# EAGLE design Test board_v3 (EAGLE 6.5.0)
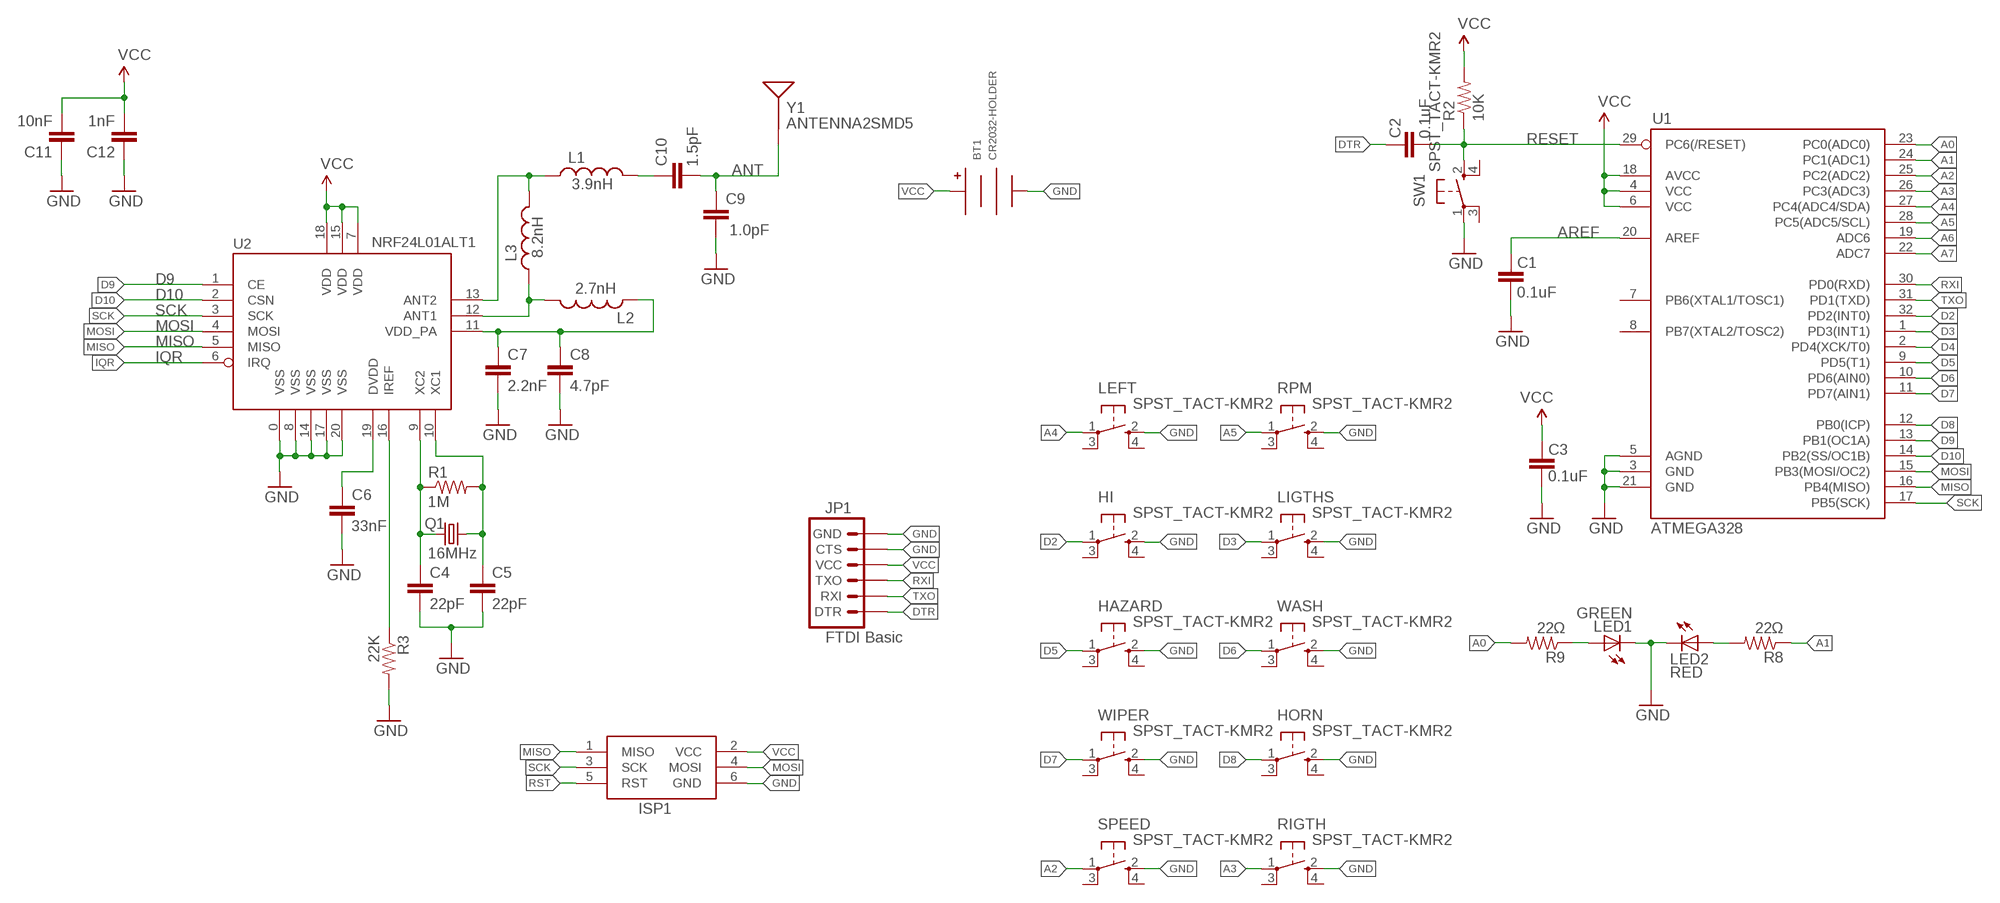
[diagram p0: schematic, sheet 1]

## Parts
BT1  CR2032-HOLDER  [CH28-2032LF]
C1  0.1uF  CAP0402-CAP  [0402-CAP]
C2  0.1uF  CAP0402-CAP  [0402-CAP]
C3  0.1uF  CAP0402-CAP  [0402-CAP]
C4  22pF  CAP0402-CAP  [0402-CAP]
C5  22pF  CAP0402-CAP  [0402-CAP]
C6  33nF  CAP0402-CAP  [0402-CAP]
C7  2.2nF  CAP0402-CAP  [0402-CAP]
C8  4.7pF  CAP0402-CAP  [0402-CAP]
C9  1.0pF  CAP0402-CAP  [0402-CAP]
C10  1.5pF  CAP0402-CAP  [0402-CAP]
C11  10nF  CAP0402-CAP  [0402-CAP]
C12  1nF  CAP0402-CAP  [0402-CAP]
HAZARD  SPST_TACT-KMR2  [KMR2]
HI  SPST_TACT-KMR2  [KMR2]
HORN  SPST_TACT-KMR2  [KMR2]
ISP1  AVRISP-6  [AVRISP]
JP1  FTDI Basic  ARDUINO_SERIAL_PROGRAMPTH  [1X06]
L1  3.9nH  INDUCTOR0402  [C0402]
L2  2.7nH  INDUCTOR0402  [C0402]
L3  8.2nH  INDUCTOR0402  [C0402]
LED1  GREEN  LEDCHIP-LED0603  [CHIP-LED0603]
LED2  RED  LEDCHIP-LED0603  [CHIP-LED0603]
LEFT  SPST_TACT-KMR2  [KMR2]
LIGTHS  SPST_TACT-KMR2  [KMR2]
Q1  16MHz  CRYSTAL5X3  [CRYSTAL-SMD-5X3]
R1  1M  RESISTOR0402-RES  [0402-RES]
R2  10K  RESISTOR0402-RES  [0402-RES]
R3  22K  RESISTOR0402-RES  [0402-RES]
R8  22Ω  R-US_R0402  [R0402]
R9  22Ω  R-US_R0402  [R0402]
RIGTH  SPST_TACT-KMR2  [KMR2]
RPM  SPST_TACT-KMR2  [KMR2]
SPEED  SPST_TACT-KMR2  [KMR2]
SW1  SPST_TACT-KMR2  [KMR2]
U1  ATMEGA328  ATMEGA168  [TQFP32-08]
U2  NRF24L01ALT1  [QFN20_ALT1]
WASH  SPST_TACT-KMR2  [KMR2]
WIPER  SPST_TACT-KMR2  [KMR2]
Y1  ANTENNA2SMD5  [ANTENNA-CHIP5]

## Nets
A0: R9.2 U1.23(PC0(ADC0))
A1: R8.1 U1.24(PC1(ADC1))
A2: SPEED.1(P) U1.25(PC2(ADC2))
A3: RIGTH.1(P) U1.26(PC3(ADC3))
A4: LEFT.1(P) U1.27(PC4(ADC4/SDA))
A5: RPM.1(P) U1.28(PC5(ADC5/SCL))
A6: U1.19(ADC6)
A7: U1.22(ADC7)
ANT: C9.2 C10.2 Y1.FEED(SIGNAL)
AREF: C1.2 U1.20(AREF)
D2: HI.1(P) U1.32(PD2(INT0))
D3: LIGTHS.1(P) U1.1(PD3(INT1))
D4: U1.2(PD4(XCK/T0))
D5: HAZARD.1(P) U1.9(PD5(T1))
D6: U1.10(PD6(AIN0)) WASH.1(P)
D7: U1.11(PD7(AIN1)) WIPER.1(P)
D8: HORN.1(P) U1.12(PB0(ICP))
D9: U1.13(PB1(OC1A)) U2.1(CE)
D10: U1.14(PB2(SS/OC1B)) U2.2(CSN)
DTR: C2.2 JP1.1(DTR)
GND [vcc]: BT1.NEG C1.1 C3.1 C4.2 C5.2 C6.2 C7.2 C8.2 C9.1 C11.1 C12.1 HAZARD.2(S) HI.2(S) HORN.2(S) ISP1.6(GND) JP1.5(CTS) JP1.6(GND) LED1.C LED2.C LEFT.2(S) LIGTHS.2(S) R3.2 RIGTH.2(S) RPM.2(S) SPEED.2(S) SW1.1(P) U1.3(GND) U1.5(AGND) U1.21(GND) U2.0(VSS) U2.8(VSS) U2.14(VSS) U2.17(VSS) U2.20(VSS) WASH.2(S) WIPER.2(S)
IQR: U2.6(IRQ)
MISO: ISP1.1(MISO) U1.16(PB4(MISO)) U2.5(MISO)
MOSI: ISP1.4(MOSI) U1.15(PB3(MOSI/OC2)) U2.4(MOSI)
N$1: C4.1 Q1.1 R1.1 U2.9(XC2)
N$2: C5.1 Q1.3 R1.2 U2.10(XC1)
N$8: L1.1 L3.2 U2.13(ANT2)
N$10: LED2.A R8.2
N$11: LED1.A R9.1
N$12: C7.1 C8.1 L2.1 U2.11(VDD_PA)
N$13: R3.1 U2.16(IREF)
N$14: C6.1 U2.19(DVDD)
N$15: L2.2 L3.1 U2.12(ANT1)
N$16: C10.1 L1.2
RESET: C2.1 R2.1 SW1.2(S) U1.29(PC6(/RESET))
RST: ISP1.5(RST)
RXI: JP1.3(TXO) U1.30(PD0(RXD))
SCK: ISP1.3(SCK) U1.17(PB5(SCK)) U2.3(SCK)
TXO: JP1.2(RXI) U1.31(PD1(TXD))
VCC: BT1.POS C3.2 C11.2 C12.2 ISP1.2(VCC) JP1.4(VCC) R2.2 U1.4(VCC) U1.6(VCC) U1.18(AVCC) U2.7(VDD) U2.15(VDD) U2.18(VDD)
Unconnected: HAZARD.3(P1) HAZARD.4(S1) HI.3(P1) HI.4(S1) HORN.3(P1) HORN.4(S1) LEFT.3(P1) LEFT.4(S1) LIGTHS.3(P1) LIGTHS.4(S1) RIGTH.3(P1) RIGTH.4(S1) RPM.3(P1) RPM.4(S1) SPEED.3(P1) SPEED.4(S1) SW1.3(P1) SW1.4(S1) U1.7(PB6(XTAL1/TOSC1)) U1.8(PB7(XTAL2/TOSC2)) WASH.3(P1) WASH.4(S1) WIPER.3(P1) WIPER.4(S1)

## Library data of the parts
BT1 = battery-holder:CR2032-HOLDER
C1-C12 = SparkFun:CAP: Capacitor Standard 0603 ceramic capacitor, and 0.1" leaded capacitor.
HAZARD HI HORN LEFT LIGTHS RIGTH RPM SPEED SW1 WASH WIPER = adafruit:SPST_TACT: SMT 6mm switch, EVQQ2 series http://www.ladyada.net/library/eagle
ISP1 = adafruit:AVRISP: AVR ISP HEADER Standard 6 pin header for AVR programming
JP1 = SparkFun:ARDUINO_SERIAL_PROGRAM
L1-L3 = SparkFun:INDUCTOR: Inductors Basic Inductor/Choke - 0603 and 1206. Footprints are not proven and vary greatly between part numbers.
LED1 LED2 = adafruit:LED: LED OSRAM: - CHIPLED LG R971, LG N971, LY N971, LG Q971, LY Q971, LO R971, LY R971 LH N974, LH R974 LS Q976, LO Q976, LY Q976 LO Q996 - Hyper CHIPLED LW Q18S LB Q993, LB Q99A, LB R99A - SideLED LS A670, LO A670, LY A670, LG A670, LP A670 LB A673, LV A673, LT A673, LW A673 LH A674 LY A675 LS A676, LA A676, LO A676, LY A676, LW A676 LS A679, LY A679, LG A679 - Hyper Micro SIDELED® LS Y876, LA Y876, LO Y876, LY Y876 LT Y87S - SmartLED LW L88C, LW L88S LB L89C, LB L89S, LG L890 LS L89K, LO L89K, LY L89K LS L896, LA L896, LO L896, LY L896 - TOPLED LS T670, LO T670, LY T670, LG T670, LP T670 LSG T670, LSP T670, LSY T670, LOP T670, LYG T670 LG T671, LOG T671, LSG T671 LB T673, LV T673, LT T673, LW T673 LH T674 LS T676, LA T676, LO T676, LY T676, LB T676, LH T676, LSB T676, LW T676 LB T67C, LV T67C, LT T67C, LS T67K, LO T67K, LY T67K, LW E67C LS E67B, LA E67B, LO E67B, LY E67B, LB E67C, LV E67C, LT E67C LW T67C LS T679, LY T679, LG T679 LS T770, LO T770, LY T770, LG T770, LP T770 LB T773, LV T773, LT T773, LW T773 LH T774 LS E675, LA E675, LY E675, LS T675 LS T776, LA T776, LO T776, LY T776, LB T776 LHGB T686 LT T68C, LB T68C - Hyper Mini TOPLED® LB M676 - Mini TOPLED Santana® LG M470 LS M47K, LO M47K, LY M47K Source: http://www.osram.convergy.de/
Q1 = SparkFun:CRYSTAL: Crystals Various standard crystals. Proven footprints. Spark Fun Electronics SKU : COM-00534
R1-R3 = SparkFun:RESISTOR: Resistor Basic schematic elements and footprints for 0603, 1206, and PTH resistors.
R8 R9 = adafruit:R-US_: RESISTOR, American symbol
U1 = SparkFun:ATMEGA168
U2 = Testing:NRF24L01: 2.4GHz Low Power Transceiver This is the very popular, low cost, very low power RF transceiver from Nordic Semiconductor. Simple SPI interface. SKU: COM-00690
Y1 = SparkFun:ANTENNA2: Antenna Single endded antenna. Common with smaller chip antennas. CHIP4 package is the GPS Chip Antenna SKU: GPS-08418. CHIP5 package is 2.4GHz chip antenna SKU: WRL-00144.

## Net classes
1 vcc: width 0.254 mm

## Board
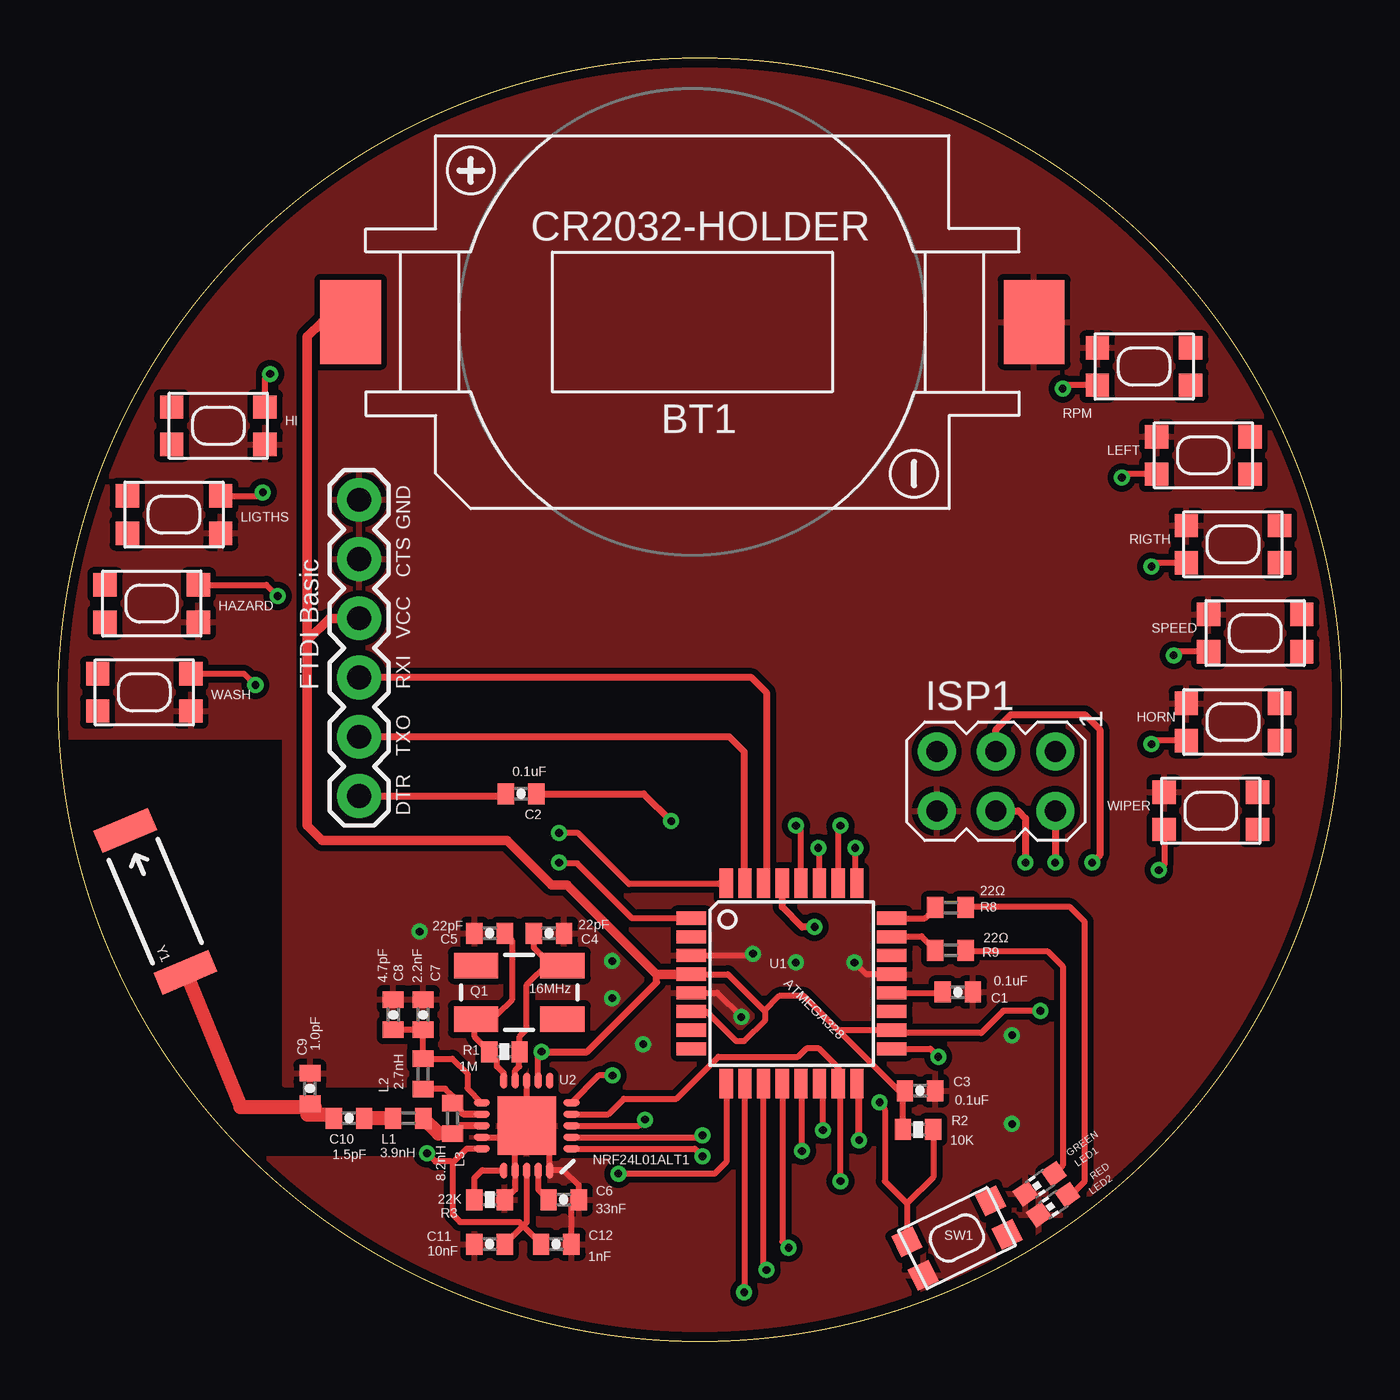
[diagram p1: board, top side]
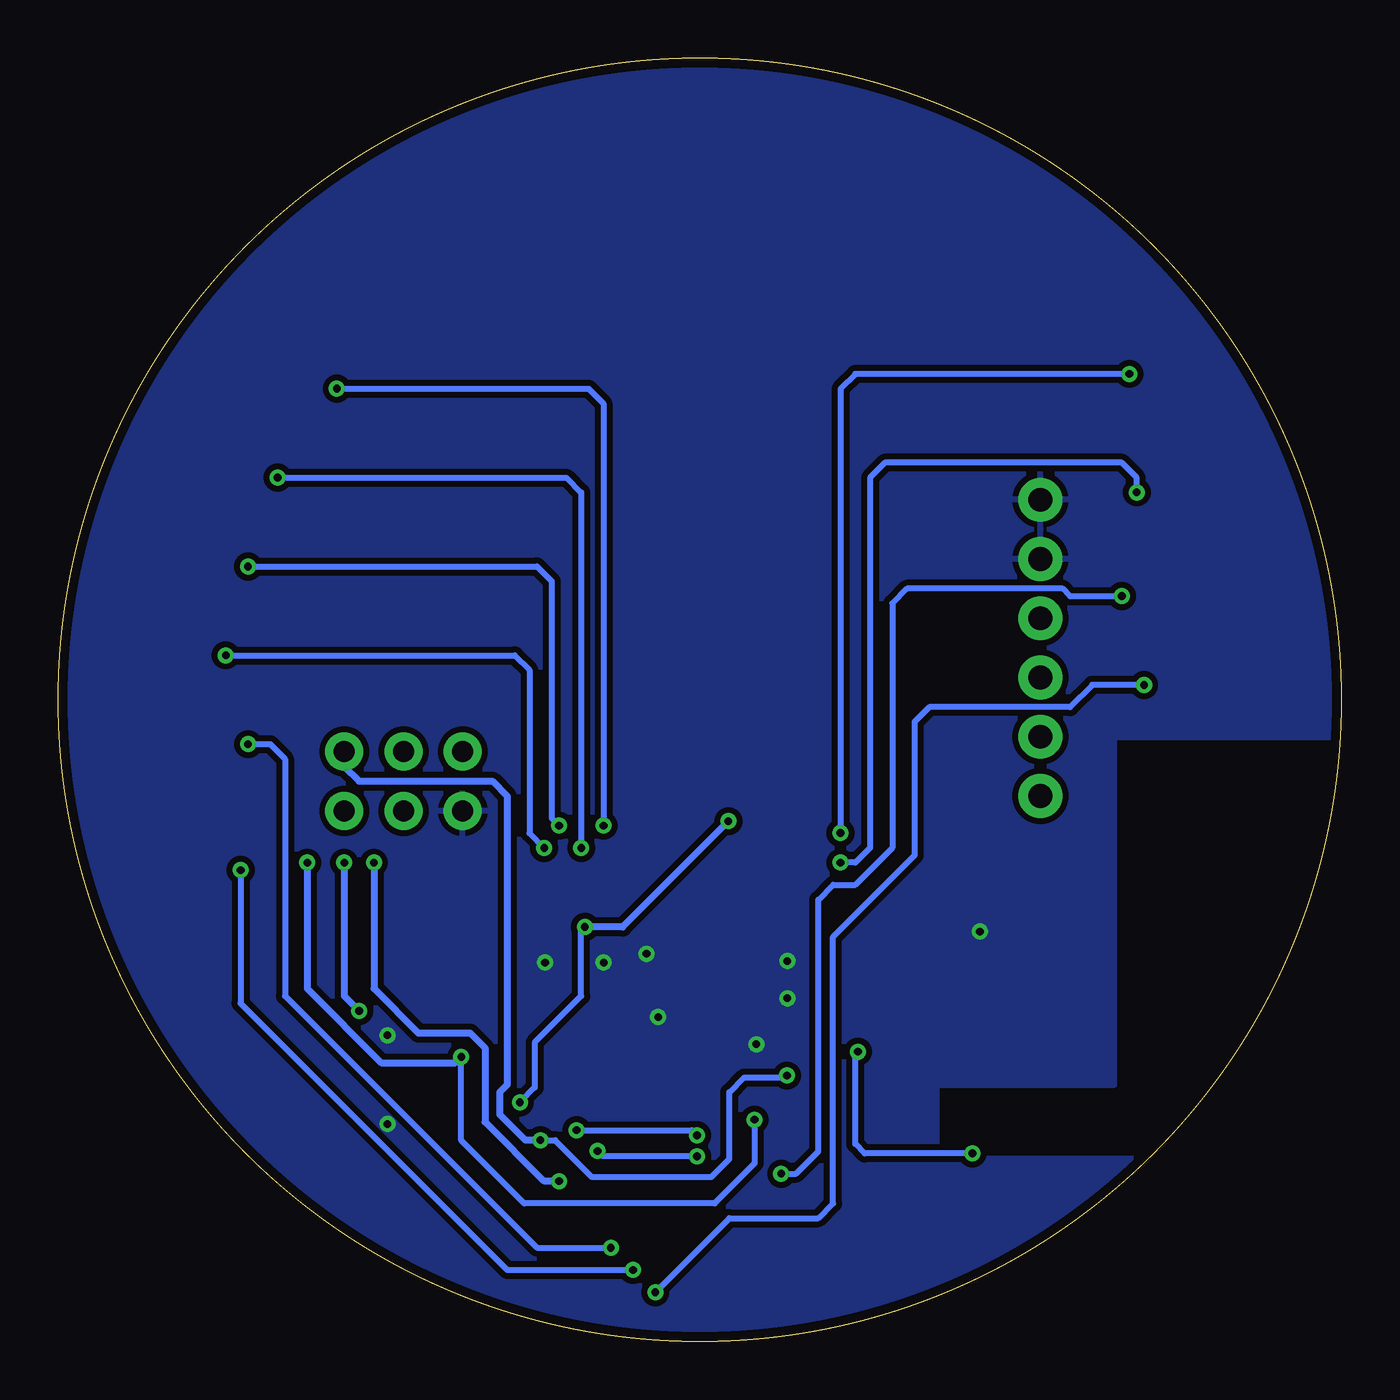
[diagram p2: board, bottom side, seen from below]

Size 55 x 55 mm. Coordinates in mm from the lower left corner, seen from the top.
Outline: circle at 27.5,27.5 radius 27.5
Copper layers (1*16): Top 0.0356mm / dielectric 1.5011mm / Bottom 0.0356mm
Design rules "oshpark-2layer": minimum track width 6mil, minimum drill 13mil, track to track 6mil, track to pad 6mil, pad to pad 6mil, via to via 6mil, smd to smd 6mil, copper to edge 15mil, drill to drill 6mil, minimum pad ring 7mil, minimum via ring 7mil, stop-mask expansion 2.5mil, vias tented up to drill 0mil, thermal gap 10mil

### Footprints (pad centres in the part's own frame; a part is rotated, then mirrored left to right if it is on the bottom)
CH28-2032LF = smd 3.6 x 2.6: NEG 0,-14.65; POS 0,14.65
0402-CAP = smd 0.7 x 0.9: 1 -0.65,0; 2 0.65,0
KMR2 = smd 1 x 1: 1 2,0.8; 2 2,-0.8; 3 -2,0.8; 4 -2,-0.8
AVRISP = drill 0.9 pad 1.626: 1 -1.27,2.54; 2 1.27,2.54; 3 -1.27,0; 4 1.27,0; 5 -1.27,-2.54; 6 1.27,-2.54
1X06 = drill 1.016 pad 1.88: 1 0,0; 2 2.54,0; 3 5.08,0; 4 7.62,0; 5 10.16,0; 6 12.7,0
C0402 = smd 0.7 x 0.9: 1 -0.65,0; 2 0.65,0
CHIP-LED0603 = smd 0.8 x 0.8: A 0,-0.75; C 0,0.75
CRYSTAL-SMD-5X3 = smd 1.9 x 1.1: 1 -1.85,-1.15; 2 1.85,-1.15; 3 1.85,1.15; 4 -1.85,1.15
0402-RES = smd 0.7 x 0.9: 1 -0.65,0; 2 0.65,0
R0402 = smd 0.7 x 0.9: 1 -0.65,0; 2 0.65,0
TQFP32-08 = smd 1.27 x 0.559: 1 -4.293,2.8; 2 -4.293,2; 3 -4.293,1.2; 4 -4.293,0.4; 5 -4.293,-0.4; 6 -4.293,-1.2; 7 -4.293,-2; 8 -4.293,-2.8; 17 4.293,-2.8; 18 4.293,-2; 19 4.293,-1.2; 20 4.293,-0.4; 21 4.293,0.4; 22 4.293,1.2; 23 4.293,2; 24 4.293,2.8 | smd 0.559 x 1.27: 9 -2.8,-4.293; 10 -2,-4.293; 11 -1.2,-4.293; 12 -0.4,-4.293; 13 0.4,-4.293; 14 1.2,-4.293; 15 2,-4.293; 16 2.8,-4.293; 25 2.8,4.293; 26 2,4.293; 27 1.2,4.293; 28 0.4,4.293; 29 -0.4,4.293; 30 -1.2,4.293; 31 -2,4.293; 32 -2.8,4.293
QFN20_ALT1 = smd 2.515 x 2.515: 0 0,0 | smd 0.686 x 0.293: 1 -1.925,0.986; 2 -1.925,0.493; 3 -1.925,0; 4 -1.925,-0.493; 5 -1.925,-0.986; 11 1.925,-0.986; 12 1.925,-0.493; 13 1.925,0; 14 1.925,0.493; 15 1.925,0.986 | smd 0.293 x 0.686: 6 -0.986,-1.925; 7 -0.493,-1.925; 8 0,-1.925; 9 0.493,-1.925; 10 0.986,-1.925; 16 0.986,1.925; 17 0.493,1.925; 18 0,1.925; 19 -0.493,1.925; 20 -0.986,1.925
ANTENNA-CHIP5 = smd 1.016 x 2.54: FEED -3.302,0; NC 3.302,0

### Placement (x,y rotation side)
BT1  27.18,43.69 90 top
C1  38.56,14.97 180 top
C2  19.84,23.47 180 top
C3  36.95,10.74 180 top
C4  21.03,17.49 0 top
C5  18.49,17.49 180 top
C6  21.67,6.06 0 top
C7  15.64,14 90 top
C8  14.36,14 90 top
C9  10.79,10.84 270 top
C10  12.46,9.56 180 top
C11  18.49,4.16 0 top
C12  21.35,4.16 180 top
HAZARD  4,31.63 0 top
HI  6.86,39.25 0 top
HORN  50.36,26.55 180 top
ISP1  40.2,24.01 270 top
JP1  12.89,23.37 90 top
L1  15,9.56 180 top
L2  15.64,11.46 270 top
L3  16.9,9.56 270 top
LED1  42.07,6.75 125 top
LED2  42.65,5.85 125 top
LEFT  49.09,37.98 180 top
LIGTHS  4.96,35.44 0 top
Q1  19.76,14.95 180 top
R1  19.13,12.41 180 top
R2  36.86,9.08 180 top
R3  18.49,6.06 0 top
R8  38.25,18.59 0 top
R9  38.25,16.76 180 top
RIGTH  50.36,34.17 180 top
RPM  46.55,41.79 180 top
SPEED  51.31,30.36 180 top
SW1  38.53,4.42 206 top
U1  31.44,15.34 0 top
U2  20.08,9.24 180 top
WASH  3.69,27.82 0 top
WIPER  49.41,22.74 180 top
Y1  4.16,18.86 113 top

### Tracks (layer width: path | path; a pad name or v marks a point on that pad's centre or on a via)
A0
  Top 0.254: U1.23 35.75,17.36 37.01,17.36 R9.2
A1
  Top 0.254: U1.24 37.14,18.13 R8.1
A2  (via drill 0.33)
  Top 0.254: U1.25 34.17,19.7 v34.17,21.15 | SPEED.1 47.97,29.56 v47.82,29.41
  Bottom 0.254: v47.82,29.41 35.44,29.41 34.8,28.77 34.8,21.79 v34.17,21.15
A3  (via drill 0.33)
  Top 0.254: U1.26 33.44,22.01 v33.53,22.1 | RIGTH.1 47.02,33.37 v46.87,33.22
  Bottom 0.254: v46.87,33.22 34.48,33.22 33.85,32.58 33.85,22.42 v33.53,22.1
A4  (via drill 0.33)
  Top 0.254: U1.27 32.64,21.09 v32.58,21.15 | LEFT.1 45.75,37.18 v45.6,37.02
  Bottom 0.254: v45.6,37.02 33.22,37.02 32.58,36.39 v32.58,21.15
A5  (via drill 0.33)
  Top 0.254: U1.28 31.84,21.89 v31.63,22.1 | RPM.1 43.21,40.99 v43.06,40.84
  Bottom 0.254: v43.06,40.84 32.26,40.84 31.63,40.2 v31.63,22.1
ANT
  Top 0.254: 11.74,9.62 C10.2 | C9.2 10.79,9.84 10.67,9.72
  Top 0.61: 10.67,9.72 10.99,9.72 | 10.99,9.72 11.65,9.72 C10.2 | Y1.FEED 7.82,10.04 10.99,10.04 10.99,9.72
AREF
  Top 0.254: U1.20 37.68,14.94 C1.2
D2  (via drill 0.33)
  Top 0.254: U1.32 28.64,19.93 28.31,19.6 24.48,19.6 22.47,21.61 22.29,21.79 v21.47,21.79 | HI.1 8.86,41.25 v9.09,41.47
  Bottom 0.254: v9.09,41.47 20.83,41.47 21.47,40.84 v21.47,21.79
D3  (via drill 0.33)
  Top 0.254: U1.1 24.59,18.13 22.25,20.48 21.5,20.48 v21.47,20.52 | LIGTHS.1 8.6,36.24 v8.77,36.39
  Bottom 0.254: v21.47,20.52 20.83,20.52 20.2,21.15 20.2,37.02 19.56,37.66 9.4,37.66 8.77,37.02 v8.77,36.39
D5  (via drill 0.33)
  Top 0.254: U1.9 28.64,7.68 28.14,7.18 v24.01,7.18 | HAZARD.1 8.92,32.43 v9.4,31.95
  Bottom 0.254: v24.01,7.18 23.37,7.18 22.42,8.13 22.42,18.93 21.79,19.56 20.83,19.56 19.24,21.15 19.24,31.63 18.61,32.26 11.94,32.26 11.62,31.95 v9.4,31.95
D6  (via drill 0.33)
  Top 0.254: U1.10 29.44,2.13 v29.41,2.1 | WASH.1 7.97,28.62 v8.45,28.14
  Bottom 0.254: v29.41,2.1 26.23,5.27 22.42,5.27 21.79,5.91 21.79,17.34 18.29,20.83 18.29,26.55 17.66,27.18 11.62,27.18 10.67,28.14 v8.45,28.14
D7  (via drill 0.33)
  Top 0.254: U1.11 30.24,3.17 v30.36,3.05 | WIPER.1 47.41,20.42 v47.19,20.2
  Bottom 0.254: v47.19,20.2 47.19,14.48 35.76,3.05 v30.36,3.05
D8  (via drill 0.33)
  Top 0.254: U1.12 31.04,4.28 v31.31,4 | HORN.1 47.02,25.75 v46.87,25.59
  Bottom 0.254: v46.87,25.59 45.91,25.59 45.28,24.96 45.28,14.8 34.48,4 v31.31,4
D9  (via drill 0.33)
  Top 0.254: U2.1 27.29,8.25 v27.62,7.93 | v31.88,8.15 31.88,10.99 U1.13
  Bottom 0.254: v27.62,7.93 31.66,7.93 v31.88,8.15
D10  (via drill 0.33)
  Top 0.254: U2.2 27.54,8.75 v27.62,8.82 | v32.78,9.05 32.78,10.9 U1.14
  Bottom 0.254: v32.78,9.05 27.84,9.05 v27.62,8.82
DTR
  Top 0.305: JP1.1 19.09,23.37 C2.2
GND  (via drill 0.33)
  Top 0.254: R3.2 19.59,6.51 U2.17 19.59,8.75 | C12.1 22,5.75 C6.2 22.32,6.68 21.67,7.33 21.09,7.33 U2.20 21.07,8.25 U2.0 | 19.59,8.75 U2.0 | U2.14 19.59,8.75 | U2.8 U2.0 | U1.3 29.7,16.54 v29.78,16.61 | U1.5 28.24,14.94 v29.28,13.9 | U1.21 34.63,15.73 v34.13,16.23
  other vias: 31.62,16.23 25.08,12.73 40.89,13.12 40.89,9.31 23.75,14.71 15.49,17.56 23.75,16.29
  pour Bottom (isolate 0.254): -0.12,55.12 55.12,55.12 55.12,-0.12 8.13,-0.12 8.13,7.82 17.34,7.82 17.34,10.99 9.72,10.99 9.72,25.91 -0.12,25.91
  pour Top (isolate 0.254): -0.12,55.12 55.12,55.12 55.12,-0.12 8.13,-0.12 8.13,7.82 17.34,7.82 17.34,10.99 9.72,10.99 9.72,25.91 -0.12,25.91
MISO  (via drill 0.33)
  Top 0.254: U2.5 23.17,11.39 v23.76,11.39
  Top 0.305: v34.33,8.62 34.33,10.95 U1.16
  Bottom 0.254: v23.76,11.39 23.84,11.31 25.59,11.31 26.23,10.67 26.23,7.82 27.02,7.03 32.11,7.03 33.7,8.62 v34.33,8.62
  Bottom 0.305: ISP1.1 42.74,24.64 42.11,24.01 36.39,24.01 35.76,23.37 35.76,10.99 36.07,10.67 36.07,9.72 34.97,8.62 v34.33,8.62
MOSI  (via drill 0.33)
  Top 0.254: U2.4 23.59,9.73 24.25,10.4 26.5,10.4 28.29,12.19 31.7,12.19 32.06,12.55 32.6,12.55 33.44,11.72 U1.15 33.53,10.95 v33.53,6.86
  Top 0.305: ISP1.4 41.15,22.74 41.47,22.42 v41.47,20.52
  Bottom 0.305: v41.47,20.52 41.47,15.12 39.56,13.21 37.34,13.21 36.71,12.58 36.71,9.4 34.17,6.86 v33.53,6.86
N$1
  Top 0.254: U2.9 19.59,11.6 19.76,11.78 19.76,12.4 R1.1 19.78,13.06 20.08,13.37 20.08,15.27 21.03,16.22 | 21.03,16.22 21.49,16.22 Q1.1 | C4.1 20.38,16.87 21.03,16.22
N$2
  Top 0.254: U2.10 19.09,11.5 18.81,11.78 18.81,12.08 R1.2 18.48,12.43 17.86,13.05 17.86,13.75 Q1.3 18.11,14 18.81,14 19.44,14.64 19.44,17.18 19.14,17.48 C5.1
N$8
  Top 0.254: 16.92,8.92 L3.2
  Top 0.305: U2.13 17.24,9.24 L3.2
  Top 0.61: L3.2 16.3,8.91 L1.1
N$10
  Top 0.254: LED2.A 43.43,6.28 44.01,6.86 44.01,17.98 43.38,18.61 38.92,18.61 R8.2
N$11
  Top 0.254: R9.1 38.96,16.7 42.42,16.7 43.06,16.07 43.06,7.55 LED1.A
N$12
  Top 0.254: U2.11 17.54,10.84 17.54,11.46 16.89,12.11 L2.1 C7.1 C8.1
N$13
  Top 0.254: R3.1 17.84,7 18.17,7.33 19.07,7.33 U2.16
N$14
  Top 0.254: U2.19 20.57,6.51 C6.1
N$15
  Top 0.254: L3.1 16.9,10.51 16.59,10.83 15.65,10.83 L2.2
  Top 0.305: U2.12 17.38,9.73 L3.1
N$16
  Top 0.61: L1.2 C10.1 | C10.1
RESET  (via drill 0.33)
  Top 0.254: v35.21,10.24 35.44,9.93 35.44,6.86 36.38,5.9 | 36.38,5.9 SW1.2 | R2.1 37.51,7.03 36.38,5.9
  Top 0.305: v32.42,17.76 31.88,17.76 31.04,18.61 U1.29 | C2.1 25.1,23.47 v26.27,22.3
  Bottom 0.254: v32.42,17.76 32.58,17.6 32.58,14.8 34.58,12.8 34.58,10.88 v35.21,10.24
  Bottom 0.305: v26.27,22.3 30.81,17.76 v32.42,17.76
RXI
  Top 0.305: U1.30 30.36,19.75 30.36,27.82 29.72,28.45 JP1.3
SCK  (via drill 0.33)
  Top 0.254: U1.17 37.38,12.54 v37.72,12.19 | U2.3 24.89,9.24 v25.15,9.5
  Top 0.305: ISP1.3 40.2,26.23 40.84,26.86 44.01,26.86 44.64,26.23 44.64,20.83 v44.33,20.52
  Bottom 0.254: v37.72,12.19 37.72,8.6 35.03,5.91 26.86,5.91 25.15,7.62 v25.15,9.5
  Bottom 0.305: v44.33,20.52 44.33,15.12 41.15,11.94 37.97,11.94 v37.72,12.19
TXO
  Top 0.305: U1.31 29.41,19.66 29.41,25.28 28.77,25.91 JP1.2
VCC  (via drill 0.33)
  Top 0.254: 33.44,13.34 33.5,13.34 33.5,13.27 | 33.5,13.27 33.44,13.34 | 33.44,13.34 31.98,14.8 30.9,14.8 30.27,14.17 | 30.27,14.17 30.31,14.12 30.31,13.76 29.41,12.87 29.06,12.87 27.79,14.13 U1.6 | 30.27,14.17 28.7,15.73 U1.4 | 33.5,13.27 35.05,11.72 36.03,10.74 C3.2 36.21,10.66 R2.2 | 33.44,13.34 U1.18 35.85,13.21 39.56,13.21 40.52,14.16 v42.11,14.16 | 27.13,15.75 U1.4 | 27,15.88 U1.4 | U2.18 20.08,5.1 19.93,4.95 | 19.93,4.95 C11.2 | C12.2 20.7,4.17 19.93,4.95 | U2.15 17.51,8.25 16.9,7.65 | 16.9,7.65 16.9,5.43 17.22,5.11 19.76,5.11 19.93,4.95 | U2.7 20.57,12.27 v20.71,12.41 | 16.9,7.65 16.85,7.7 16.17,7.7 v15.82,8.05 v15.81,8.05
  Top 0.305: v20.71,12.41 22.68,12.41 25.65,15.38 25.65,15.73 | ISP1.2 v42.74,20.52
  Top 0.406: U1.4 25.65,15.73 21.82,19.56 21.15,19.56 19.24,21.47 11.31,21.47 10.67,22.1 10.67,30.04 | 10.67,30.04 11.62,30.99 JP1.4 | BT1.POS 11.31,43.69 10.67,43.06 10.67,30.04
  Bottom 0.254: v15.81,8.05 20.43,8.05 20.83,8.45 20.83,12.3 v20.71,12.41
  Bottom 0.305: v42.74,20.52 42.74,14.8 v42.11,14.16

### Text on the board
tNames: HI | RPM | LEFT | GND | LIGTHS | CTS | RIGTH | HAZARD | VCC | SPEED | RXI | WASH | TXO | HORN | DTR | WIPER | C5 | C4 | C8 | C7 | Q1 | C9 | R1 | L2 | U2 | C10 | L1 | L3 | C6 | R3 | C12 | SW1